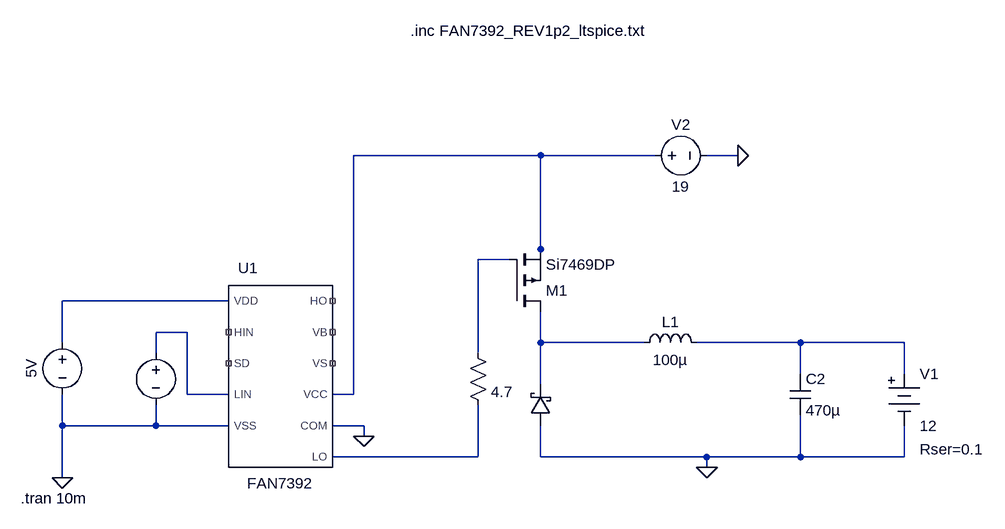
[diagram p0: schematic PMOSFET.asc]
PMOSFET.asc, the LTspice schematic file:
Version 4
SHEET 1 2264 680
WIRE 608 -176 320 -176
WIRE 784 -176 608 -176
WIRE 912 -176 864 -176
WIRE 608 -32 608 -176
WIRE 560 -16 512 -16
WIRE 608 0 608 -32
WIRE 128 48 -128 48
WIRE 64 96 16 96
WIRE -128 112 -128 48
WIRE 608 112 608 64
WIRE 768 112 608 112
WIRE 1008 112 848 112
WIRE 1168 112 1008 112
WIRE 16 128 16 96
WIRE 512 128 512 -16
WIRE 1008 160 1008 112
WIRE 1168 160 1168 112
WIRE 608 176 608 112
WIRE 64 192 64 96
WIRE 128 192 64 192
WIRE 320 192 320 -176
WIRE 320 192 288 192
WIRE -128 240 -128 192
WIRE 16 240 16 208
WIRE 16 240 -128 240
WIRE 128 240 16 240
WIRE 336 240 288 240
WIRE 336 256 336 240
WIRE 512 288 512 208
WIRE 512 288 288 288
WIRE 608 288 608 240
WIRE 864 288 608 288
WIRE 1008 288 1008 224
WIRE 1008 288 864 288
WIRE 1168 288 1168 240
WIRE 1168 288 1008 288
WIRE 864 304 864 288
WIRE -128 320 -128 240
FLAG 912 -176 0
FLAG -128 320 0
FLAG 336 256 0
FLAG 864 304 0
SYMBOL Gate\ drivers\\FAN7392 208 160 R0
SYMATTR InstName U1
SYMBOL ind 752 128 R270
WINDOW 0 32 56 VTop 2
WINDOW 3 5 56 VBottom 2
SYMATTR InstName L1
SYMATTR Value 100µ
SYMBOL voltage 768 -176 R270
WINDOW 0 32 56 VTop 2
WINDOW 3 -32 56 VBottom 2
WINDOW 123 0 0 Left 0
WINDOW 39 0 0 Left 0
SYMATTR InstName V2
SYMATTR Value 19
SYMBOL voltage -128 96 R0
WINDOW 0 32 56 Invisible 2
WINDOW 3 -32 56 VBottom 2
WINDOW 123 0 0 Left 0
WINDOW 39 0 0 Left 0
SYMATTR InstName V3
SYMATTR Value 5V
SYMBOL voltage 16 112 R0
WINDOW 0 24 16 Invisible 2
WINDOW 3 24 96 Invisible 2
WINDOW 123 0 0 Left 0
WINDOW 39 0 0 Left 0
SYMATTR InstName V4
SYMATTR Value PULSE(0v 5v 1n 1n 1n 7u 20u)
SYMBOL cap 992 160 R0
SYMATTR InstName C2
SYMATTR Value 470µ
SYMBOL schottky 624 240 R180
WINDOW 0 24 64 Invisible 2
WINDOW 3 24 0 Invisible 2
SYMATTR InstName D2
SYMATTR Value MBR745
SYMATTR Description Diode
SYMATTR Type diode
SYMBOL pmos 560 64 M180
SYMATTR InstName M1
SYMATTR Value Si7469DP
SYMBOL res 496 112 R0
WINDOW 0 36 40 Invisible 2
SYMATTR InstName R1
SYMATTR Value 4.7
SYMBOL Misc\\battery 1168 144 R0
WINDOW 123 0 0 Left 0
WINDOW 39 24 132 Left 2
SYMATTR SpiceLine Rser=0.1
SYMATTR InstName V1
SYMATTR Value 12
TEXT -192 352 Left 2 !.tran 10m
TEXT 408 -368 Left 2 !.inc FAN7392_REV1p2_ltspice.txt

The netlist it stands for:
* PMOSFET.asc
XU1 N001 0 NC_01 N004 N003 NC_02 NC_03 NC_04 0 NC_05 N007 FAN7392  ; pins VCC COM HIN LIN VDD VB VS HO VSS SD LO
L1 N005 N006 100µ
V2 N001 0 19
V3 N003 0 5V
V4 N004 0 PULSE(0v 5v 1n 1n 1n 7u 20u)
C2 N006 0 470µ
D2 0 N005 MBR745
M1 N005 N002 N001 N001 Si7469DP
R1 N002 N007 4.7
V1 N006 0 12 Rser=0.1
.model D D
.lib standard.dio
.model NMOS NMOS
.model PMOS PMOS
.lib standard.mos
.tran 10m
.inc FAN7392_REV1p2_ltspice.txt
.backanno
.end